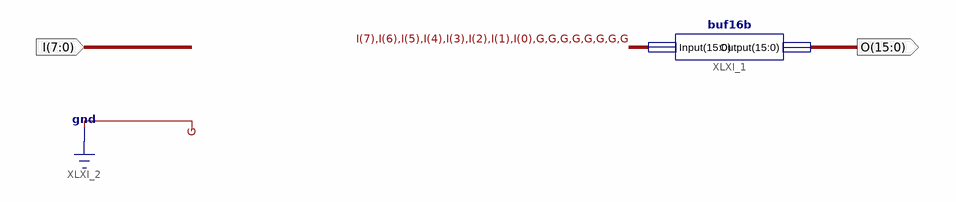
[diagram p0: schematic sheet 1]
// Xilinx ISE schematic loadupper8b.sch (spartan3e) as structural Verilog: 1 symbols, 2 ports
module loadupper8b (
  input  [7:0] I,
  output [15:0] O
);

  buf16b XLXI_1 (.Input({I, {8{1'b0}}}), .Output(O));
endmodule
